# Altium schematic sheet nRF24L01_Connet.SchDoc
size A4
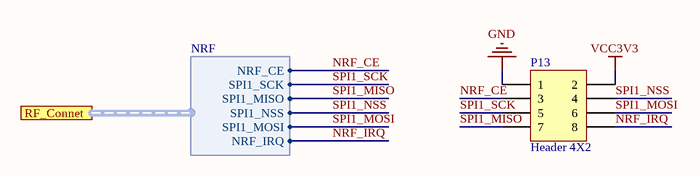
[diagram p0: nRF24L01_Connet.SchDoc]

## Parts
P13  Header 4X2  [HDR2X4]

## Ports
RF_Connet (harness NRF)

## Harnesses
NRF: NRF_CE, SPI1_SCK, SPI1_MISO, SPI1_NSS, SPI1_MOSI, NRF_IRQ

## Nets
GND: P13.1
VCC3V3: P13.2
NRF_CE: P13.3 ; port RF_Connet.NRF_CE
NRF_IRQ: P13.8 ; port RF_Connet.NRF_IRQ
SPI1_MISO: P13.7 ; port RF_Connet.SPI1_MISO
SPI1_MOSI: P13.6 ; port RF_Connet.SPI1_MOSI
SPI1_NSS: P13.4 ; port RF_Connet.SPI1_NSS
SPI1_SCK: P13.5 ; port RF_Connet.SPI1_SCK

## Library data of the parts
P13 = Header 4X2: Header, 4-Pin, Dual row; LatestRevisionDate: 17-Jul-2002; LatestRevisionNote: Re-released for DXP Platform.; Publisher: Altium Limited